# EAGLE design flash-breakout (EAGLE 8.7.1)
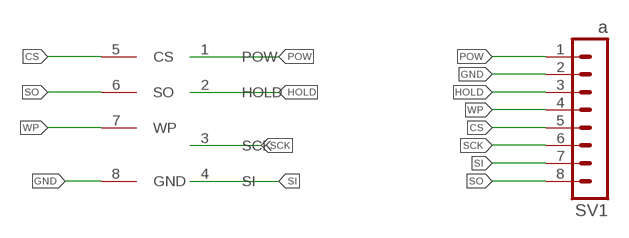
[diagram p0: schematic, sheet 1]

## Parts
SV1  a  MA08-1  [MA08-1]
U$1  AT25SF161-UUD-T  [AT25SF161-UUD-T]

## Nets
CS: SV1.5 U$1.5(CS)
GND: SV1.2 U$1.8(GND)
HOLD: SV1.3 U$1.2(HOLD)
POW: SV1.1 U$1.1(POW)
SCK: SV1.6 U$1.3(SCK)
SI: SV1.7 U$1.4(SI)
SO: SV1.8 U$1.6(SO)
WP: SV1.4 U$1.7(WP)

## Library data of the parts
SV1 = con-lstb:MA08-1: PIN HEADER; OC_FARNELL: unknown; OC_NEWARK: unknown
U$1 = AT25SF161-UUD-T:AT25SF161-UUD-T

## Board
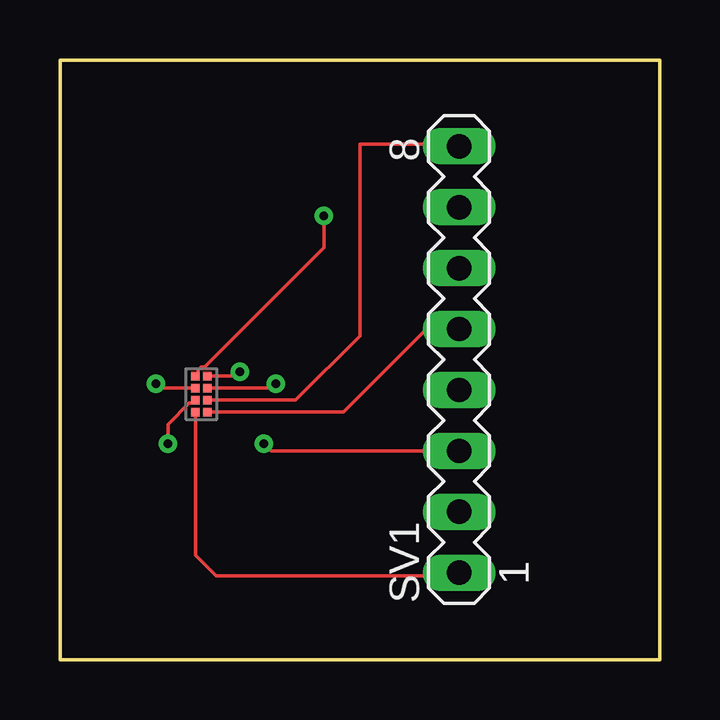
[diagram p1: board, top side]
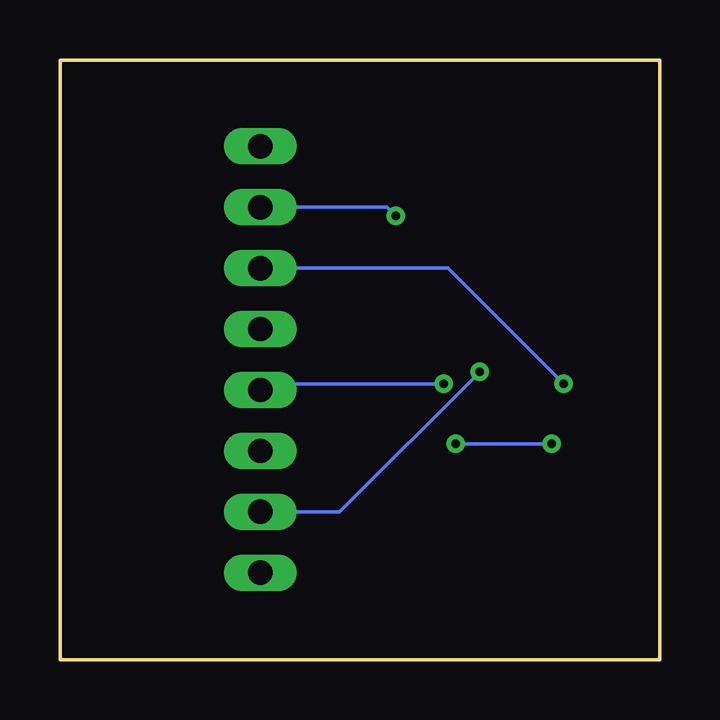
[diagram p2: board, bottom side, seen from below]

Size 25 x 25 mm. Coordinates in mm from the lower left corner, seen from the top.
Outline: 0,0 25,0 25,25 0,25 0,0
Copper layers (1*16): Top 0.035mm / dielectric 1.5mm / Bottom 0.035mm
Design rules "default *": minimum track width 5mil, minimum drill 10mil, track to track 5mil, track to pad 5mil, pad to pad 5mil, via to via 5mil, smd to smd 5mil, copper to edge 40mil, drill to drill 6mil, minimum pad ring 10mil, minimum via ring 8mil, stop-mask expansion 4mil, vias tented up to drill 0mil, thermal gap 10mil

### Footprints (pad centres in the part's own frame; a part is rotated, then mirrored left to right if it is on the bottom)
MA08-1 = drill 1.016 long: 1 -8.89,0; 2 -6.35,0; 3 -3.81,0; 4 -1.27,0; 5 1.27,0; 6 3.81,0; 7 6.35,0; 8 8.89,0
AT25SF161-UUD-T = smd 0.35 x 0.35: 1 1.2,0.9; 2 1.2,0.4; 3 1.2,-0.1; 4 1.2,-0.6; 5 0.7,0.9; 6 0.7,0.4; 7 0.7,-0.1; 8 0.7,-0.6

### Placement (x,y rotation side)
SV1  16.64,12.51 90 top
U$1  6.85,11.22 180 top

### Tracks (layer width: path | path; a pad name or v marks a point on that pad's centre or on a via)
CS
  Top 0.152: U$1.5 11.82,10.32 15.28,13.78 SV1.5
GND  (via drill 0.35)
  Top 0.152: U$1.8 7.32,11.82 v7.5,12
  Bottom 0.152: v7.5,12 13.34,6.16 SV1.2
HOLD  (via drill 0.35)
  Top 0.152: U$1.2 5.53,10.7 5.39,10.7 4.5,9.81 v4.5,9 | v8.5,9 8.8,8.7 SV1.3
  Bottom 0.152: v4.5,9 v8.5,9
POW
  Top 0.152: U$1.1 5.65,4.35 6.5,3.5 16.52,3.5 SV1.1
SCK  (via drill 0.35)
  Top 0.152: v4,11.5 4.18,11.32 U$1.3
  Bottom 0.152: SV1.6 8.82,16.32 v4,11.5
SI  (via drill 0.35)
  Top 0.152: v11,18.5 11,17.17 6.03,12.2 5.89,12.2 5.77,12.08 5.77,11.94 U$1.4
  Bottom 0.152: v11,18.5 11.36,18.86 SV1.7
SO
  Top 0.152: U$1.6 9.82,10.82 12.5,13.5 12.5,21.5 16.54,21.5 SV1.8
WP  (via drill 0.35)
  Top 0.152: U$1.7 8.82,11.32 v9,11.5
  Bottom 0.152: v9,11.5 16.38,11.5 SV1.4